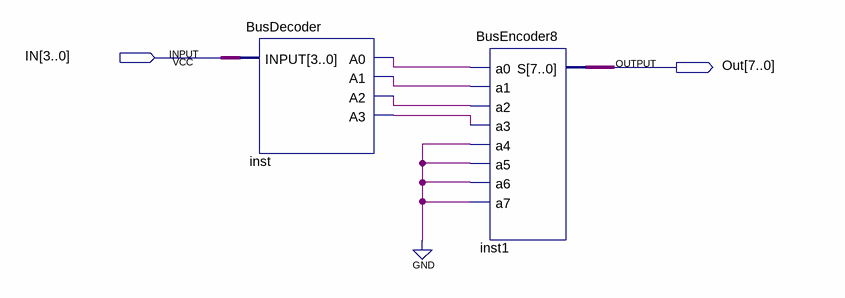
[diagram p0: schematic sheet]
// Quartus schematic Convert4To8.bdf as structural Verilog: 2 symbols, 2 pins
module Convert4To8 (
  input  [3:0] IN,
  output [7:0] Out
);

  wire inst_a0, inst_a1, inst_a2, inst_a3;

  BusDecoder inst (.INPUT(IN), .A0(inst_a0), .A1(inst_a1), .A2(inst_a2), .A3(inst_a3));
  BusEncoder8 inst1 (
    .a0(inst_a0), .a1(inst_a1), .a2(inst_a2), .a3(inst_a3), .a4(1'b0), .a5(1'b0), .a6(1'b0), .a7(1'b0),
    .S(Out));
endmodule
